# Altium schematic sheet [04] - USB INTERFACE.SchDoc
size A4; DocumentNumber: 4; SheetNumber: 4; SheetTotal: 14
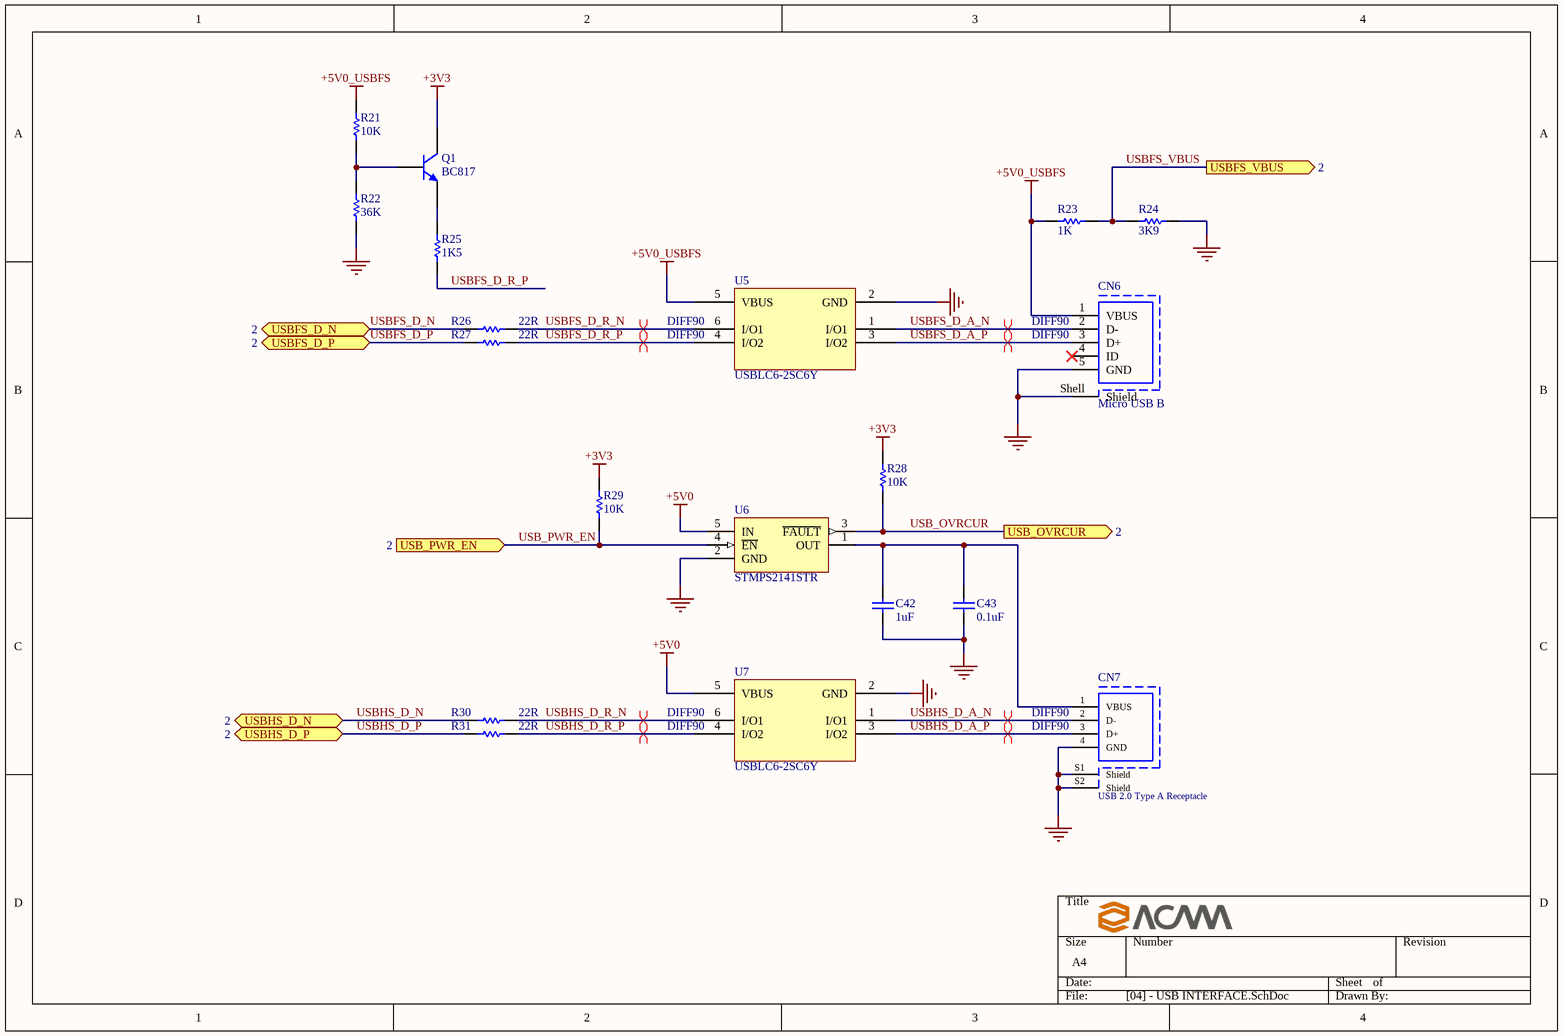
[diagram p0: [04] - USB INTERFACE.SchDoc]

## Parts
C42  1uF  [0805_C_AUTO]
C43  0.1uF  [0805_C_AUTO]
CN6  Micro USB B  [USB_Micro_B]
CN7  USB 2.0 Type A Receptacle  [USB_Type_A]
Q1  BC817  [SOT23]
R21  10K  [0402_R]
R22  36K  [0402_R]
R23  1K  [0402_R]
R24  3K9  [0402_R]
R25  1K5  [0402_R]
R26  22R  [0402_R]
R27  22R  [0402_R]
R28  10K  [0402_R]
R29  10K  [0402_R]
R30  22R  [0402_R]
R31  22R  [0402_R]
U5  USBLC6-2SC6Y  [SOT23-6L]
U6  STMPS2141STR  [SOT-23-5pin]
U7  USBLC6-2SC6Y  [SOT23-6L]

## Ports
USB_OVRCUR (out, see 2), USB_PWR_EN (in, see 2), USBFS_D_N (bidir, see 2), USBFS_D_P (bidir, see 2), USBFS_VBUS (out, see 2), USBHS_D_N (bidir, see 2), USBHS_D_P (bidir, see 2)

## Nets
+3V3: Q1.3(C) R28.1 R29.1
+5V0: U6.5(IN) U7.5(VBUS)
+5V0_USBFS: CN6.1(VBUS) R21.2 R23.2 U5.5(VBUS)
GND: C42.1 C43.1 CN6.5(GND) CN6.Shell(Shield) CN7.4(GND) CN7.S1(Shield) CN7.S2(Shield) R22.1 R24.1 U5.2(GND) U6.2(GND) U7.2(GND)
USB_OVRCUR: R28.2 U6.3(~{FAULT}) ; port USB_OVRCUR
USB_PWR_EN: R29.2 U6.4(~{EN}) ; port USB_PWR_EN
USBFS_D_A_N: CN6.2(D-) U5.1(I/O1)
USBFS_D_A_P: CN6.3(D+) U5.3(I/O2)
USBFS_D_N: R26.1 ; port USBFS_D_N
USBFS_D_P: R27.1 ; port USBFS_D_P
USBFS_D_R_N: R26.2 U5.6(I/O1)
USBFS_D_R_P: R25.1 R27.2 U5.4(I/O2)
USBFS_VBUS: R23.1 R24.2 ; port USBFS_VBUS
USBHS_D_A_N: CN7.2(D-) U7.1(I/O1)
USBHS_D_A_P: CN7.3(D+) U7.3(I/O2)
USBHS_D_N: R30.1 ; port USBHS_D_N
USBHS_D_P: R31.1 ; port USBHS_D_P
USBHS_D_R_N: R30.2 U7.6(I/O1)
USBHS_D_R_P: R31.2 U7.4(I/O2)
NetC42_2: C42.2 C43.2 CN7.1(VBUS) U6.1(OUT)
NetQ1_1: Q1.1(B) R21.1 R22.2
NetQ1_2: Q1.2(E) R25.2

Not connected (* = marked no-connect by the designer): CN6 4(ID)*

## Layout directives
differential pair; differential pair class DIFF90: USBFS_D_A_N, USBFS_D_A_P, USBFS_D_R_N, USBFS_D_R_P, USBHS_D_A_N, USBHS_D_A_P, USBHS_D_R_N, USBHS_D_R_P

## Library data of the parts
C42 C43 = Cap SMD: Non-Pol SMD Capacitor; RATED_VOLTAGE: 16V; Manufacturer Part Num: *
  C42: Value: 1uF
  C43: Value: 0.1uF
CN6 = USB Micro B #1: Micro USB 2.0 Type B Receptacle; Value: Micro USB B
CN7 = USB Type A: USB 2.0 Type A, Receptacle, Horizontal, THT; Value: USB 2.0 Type A Receptacle
Q1 = Transistor NPN: NPN General Purpose Transistor; Value: BC817; Manufacturer Part Num: *
R21-R24 R26-R31 = Res SMD: SMD Resistor; Tolerance: 5%; Manufacturer Part Num: *
  R21 R28 R29: Value: 10K
  R22: Value: 36K
  R23: Value: 1K
  R24: Value: 3K9
  R26 R27 R30 R31: Value: 22R
R25 = Res SMD: SMD Resistor; Tolerance: 1%; Value: 1K5; Manufacturer Part Num: *
U5 U7 = USBLC6-2: Very low capacitance ESD protection; Value: USBLC6-2SC6Y
U6 = STMPS2141: Value: STMPS2141STR